# Altium schematic sheet MCU.SchDoc
size A4
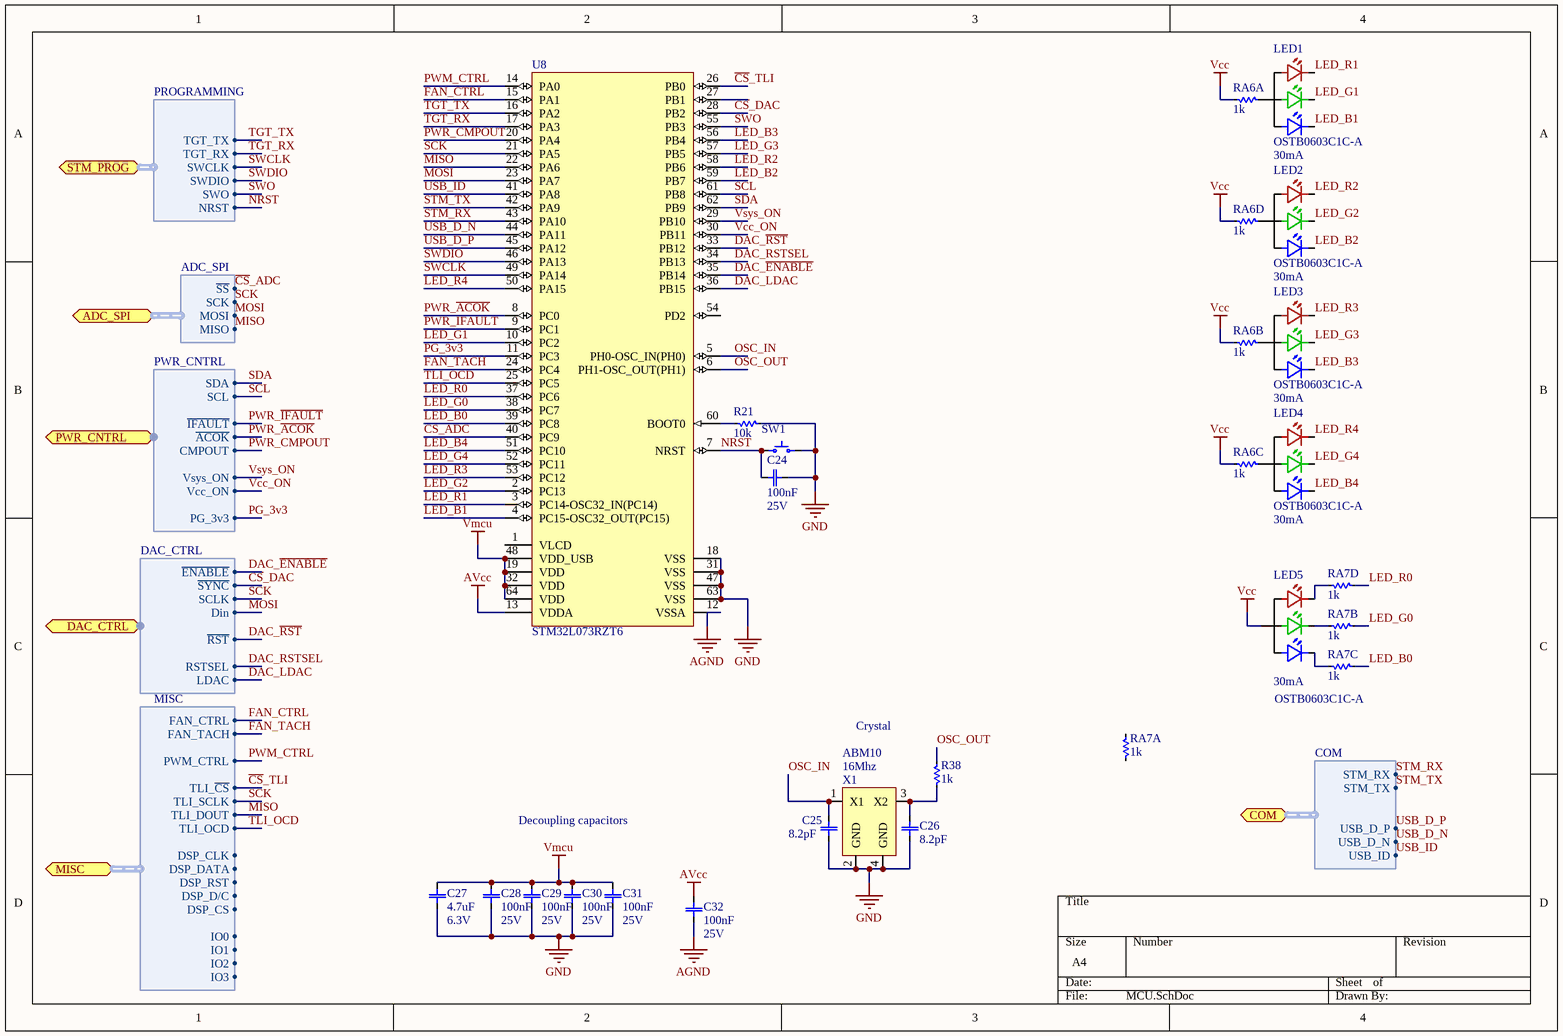
[diagram p0: MCU.SchDoc]

## Parts
C24  Capacitance: 100nF  [CAP0402]  (hidden comment: 25V)
C25  Capacitance: 8.2pF  [CAP0402]  (hidden comment: 25V)
C26  Capacitance: 8.2pF  [CAP0402]  (hidden comment: 25V)
C27  Capacitance: 4.7uF  [CAP0603]  (hidden comment: 6.3V)
C28  Capacitance: 100nF  [CAP0402]  (hidden comment: 25V)
C29  Capacitance: 100nF  [CAP0402]  (hidden comment: 25V)
C30  Capacitance: 100nF  [CAP0402]  (hidden comment: 25V)
C31  Capacitance: 100nF  [CAP0402]  (hidden comment: 25V)
C32  Capacitance: 100nF  [CAP0402]  (hidden comment: 25V)
LED1  OSTB0603C1C-A  Forward current: 30mA  [LED-RGB-1615-CA-OSTB0603C1C-A]
LED2  OSTB0603C1C-A  Forward current: 30mA  [LED-RGB-1615-CA-OSTB0603C1C-A]
LED3  OSTB0603C1C-A  Forward current: 30mA  [LED-RGB-1615-CA-OSTB0603C1C-A]
LED4  OSTB0603C1C-A  Forward current: 30mA  [LED-RGB-1615-CA-OSTB0603C1C-A]
LED5  OSTB0603C1C-A  Forward current: 30mA  [LED-RGB-1615-CA-OSTB0603C1C-A]
R21  Resistance: 10k  [RES0402]  (hidden comment: resistor)
R38  Resistance: 1k  [RES0402]  (hidden comment: resistor)
RA6  Resistance: 1k  [CAC-50P200X100-8L]  (hidden comment: quad_resistor)  (parts A,B,C,D of 4)
RA7  Resistance: 1k  [CAC-50P200X100-8L]  (hidden comment: quad_resistor)  (parts A,B,C,D of 4)
SW1  SPST_PUSHBUTTON  [B3U-1000P]  (value not drawn)
U8  STM32L073RZT6  [STM-LQFP64_N]
X1  ABM10  Frequency: 16Mhz  [XTAL-2.5x2.0]

## Ports
ADC_SPI (harness ADC_SPI), COM (harness COM), DAC_CTRL (harness DAC_CTRL), MISC (harness MISC), PWR_CNTRL (harness PWR_CNTRL), STM_PROG (harness PROGRAMMING)

## Harnesses
ADC_SPI: SCK, MOSI, MISO, ~{SS}
PWR_CNTRL: SDA, SCL, ~{ACOK}, ~{IFAULT}, CMPOUT, Vsys_ON, Vcc_ON, PG_3v3
DAC_CTRL: ~{ENABLE}, ~{SYNC}, SCLK, Din, ~{RST}, RSTSEL, LDAC
MISC: FAN_CTRL, PWM_CTRL, FAN_TACH, DSP_CLK, DSP_DATA, DSP_RST, DSP_D/C, DSP_CS, TLI_~{CS}, TLI_SCLK, TLI_DOUT, TLI_OCD, IO0, IO1, IO2, IO3
PROGRAMMING: NRST, SWDIO, SWCLK, TGT_RX, TGT_TX, SWO
COM: STM_RX, STM_TX, USB_D_P, USB_D_N, USB_ID

## Nets
AGND: C32.2 U8.12(VSSA)
AVcc: C32.1 U8.13(VDDA)
GND: C24.2 C25.1 C26.1 C27.1 C28.2 C29.2 C30.2 C31.2 R21.2 SW1.2 U8.18(VSS) U8.31(VSS) U8.47(VSS) U8.63(VSS) X1.2(GND) X1.4(GND)
Vcc: LED5.A RA6.5 RA6.6 RA6.7 RA6.8
Vmcu: C27.2 C28.1 C29.1 C30.1 C31.1 U8.19(VDD) U8.32(VDD) U8.48(VDD_USB) U8.64(VDD)
~{CS}_ADC: U8.40(PC9) ; port ADC_SPI.~{SS}
~{CS}_DAC: U8.28(PB2) ; port DAC_CTRL.~{SYNC}
~{CS}_TLI: U8.26(PB0) ; port MISC.TLI_~{CS}
DAC_~{ENABLE}: U8.35(PB14) ; port DAC_CTRL.~{ENABLE}
DAC_LDAC: U8.36(PB15) ; port DAC_CTRL.LDAC
DAC_~{RST}: U8.33(PB12) ; port DAC_CTRL.~{RST}
DAC_RSTSEL: U8.34(PB13) ; port DAC_CTRL.RSTSEL
FAN_CTRL: U8.15(PA1) ; port MISC.FAN_CTRL
FAN_TACH: U8.24(PC4) ; port MISC.FAN_TACH
LED_B0: RA7.5 U8.39(PC8)
LED_B1: LED1.B(Blue) U8.4(PC15-OSC32_OUT(PC15))
LED_B2: LED2.B(Blue) U8.59(PB7)
LED_B3: LED3.B(Blue) U8.56(PB4)
LED_B4: LED4.B(Blue) U8.51(PC10)
LED_G0: RA7.6 U8.38(PC7)
LED_G1: LED1.G(Green) U8.10(PC2)
LED_G2: LED2.G(Green) U8.2(PC13)
LED_G3: LED3.G(Green) U8.57(PB5)
LED_G4: LED4.G(Green) U8.52(PC11)
LED_R0: RA7.7 U8.37(PC6)
LED_R1: LED1.R(Red) U8.3(PC14-OSC32_IN(PC14))
LED_R2: LED2.R(Red) U8.58(PB6)
LED_R3: LED3.R(Red) U8.53(PC12)
LED_R4: LED4.R(Red) U8.50(PA15)
MISO: U8.22(PA6) ; port ADC_SPI.MISO, port MISC.TLI_DOUT
MOSI: U8.23(PA7) ; port ADC_SPI.MOSI, port DAC_CTRL.Din
NRST: C24.1 SW1.1 U8.7(NRST) ; port STM_PROG.NRST
OSC_IN: C25.2 U8.5(PH0-OSC_IN(PH0)) X1.1(X1)
OSC_OUT: R38.2 U8.6(PH1-OSC_OUT(PH1))
PG_3v3: U8.11(PC3) ; port PWR_CNTRL.PG_3v3
PWM_CTRL: U8.14(PA0) ; port MISC.PWM_CTRL
PWR_~{ACOK}: U8.8(PC0) ; port PWR_CNTRL.~{ACOK}
PWR_CMPOUT: U8.20(PA4) ; port PWR_CNTRL.CMPOUT
PWR_~{IFAULT}: U8.9(PC1) ; port PWR_CNTRL.~{IFAULT}
SCK: U8.21(PA5) ; port ADC_SPI.SCK, port DAC_CTRL.SCLK, port MISC.TLI_SCLK
SCL: U8.61(PB8) ; port PWR_CNTRL.SCL
SDA: U8.62(PB9) ; port PWR_CNTRL.SDA
STM_RX: U8.43(PA10) ; port COM.STM_RX
STM_TX: U8.42(PA9) ; port COM.STM_TX
SWCLK: U8.49(PA14) ; port STM_PROG.SWCLK
SWDIO: U8.46(PA13) ; port STM_PROG.SWDIO
SWO: U8.55(PB3) ; port STM_PROG.SWO
TGT_RX: U8.17(PA3) ; port STM_PROG.TGT_RX
TGT_TX: U8.16(PA2) ; port STM_PROG.TGT_TX
TLI_OCD: U8.25(PC5) ; port MISC.TLI_OCD
USB_D_N: U8.44(PA11) ; port COM.USB_D_N
USB_D_P: U8.45(PA12) ; port COM.USB_D_P
USB_ID: U8.41(PA8) ; port COM.USB_ID
Vcc_ON: U8.30(PB11) ; port PWR_CNTRL.Vcc_ON
Vsys_ON: U8.29(PB10) ; port PWR_CNTRL.Vsys_ON
NetC26_2: C26.2 R38.1 X1.3(X2)
NetLED1_A: LED1.A RA6.1
NetLED2_A: LED2.A RA6.2
NetLED3_A: LED3.A RA6.3
NetLED4_A: LED4.A RA6.4
NetLED5_B: LED5.B(Blue) RA7.4
NetLED5_G: LED5.G(Green) RA7.3
NetLED5_R: LED5.R(Red) RA7.2
NetR21_1: R21.1 U8.60(BOOT0)

Not connected (* = marked no-connect by the designer): RA7 1 8; U8 1(VLCD) 27(PB1) 54(PD2)

## Notes on the sheet
- Crystal
- Decoupling capacitors

## Library data of the parts
C24-C32 = capacitor: Tolerance: 10%; Dielectric: X5R
  C24-C26 C28-C32: Voltage: 25V
  C27: Voltage: 6.3V
LED1-LED5 = RGB-LED-CA: pin to pad: A>1 B>3 G>4 R>2; Vred: 2.0V; Vgreen: 2.6V; Vblue: 2.8V
R21 R38 = resistor: Power: 0.063W; Tolerance: 1%
SW1 = SPST_PUSHBUTTON: Standard 2-contact pushbutton; Max voltage: 24V; Max current: 50mA
U8 = CMP-1546-00073-1: Ultra-Low-Power ARM Cortex-M0+ MCU, 192 KB Flash, 20 KB Internal RAM, 51 I/Os, 64-Pin LQFP, -40 to 85 degC, Tray; Internal RAM Size (kB): 20; Data E2PROM nom (B): 6144; FLASH Size (Prog) (kB): 192; Operating Frequency(F) (Processor speed) (MHz): 32; D/A Converter: 2; I/Os (High Current): 51; Supply Voltage(Vcc) min (V): 1.8; ComponentLink1Description: Manufacturer URL; ComponentLink2Description: Datasheet; DatasheetVersion: Rev. 2; Mounting Technology: Surface Mount; Package Description: 64-Pin Low-profile Quad Flat Package, Body 10 x 10 mm, Pitch 0.5 mm; ComponentLink2URL: http://www.st.com/st-web-ui/static/active/en/resource/technical/document/datasheet/DM00141036.pdf; Core: ARM Cortex-M0+; Packing: Tray; ComponentLink1URL: http://www.st.com/; Package Reference: LQFP64
X1 = XTAL-4pin: 4pin crystal with 2 GND pins; Stability: 20ppm; Load capacitance: 10pF; Shunt capacitance: 7pF